# EAGLE schematic Meshtastic-DIY_v1.05 (EAGLE 9.6.2)
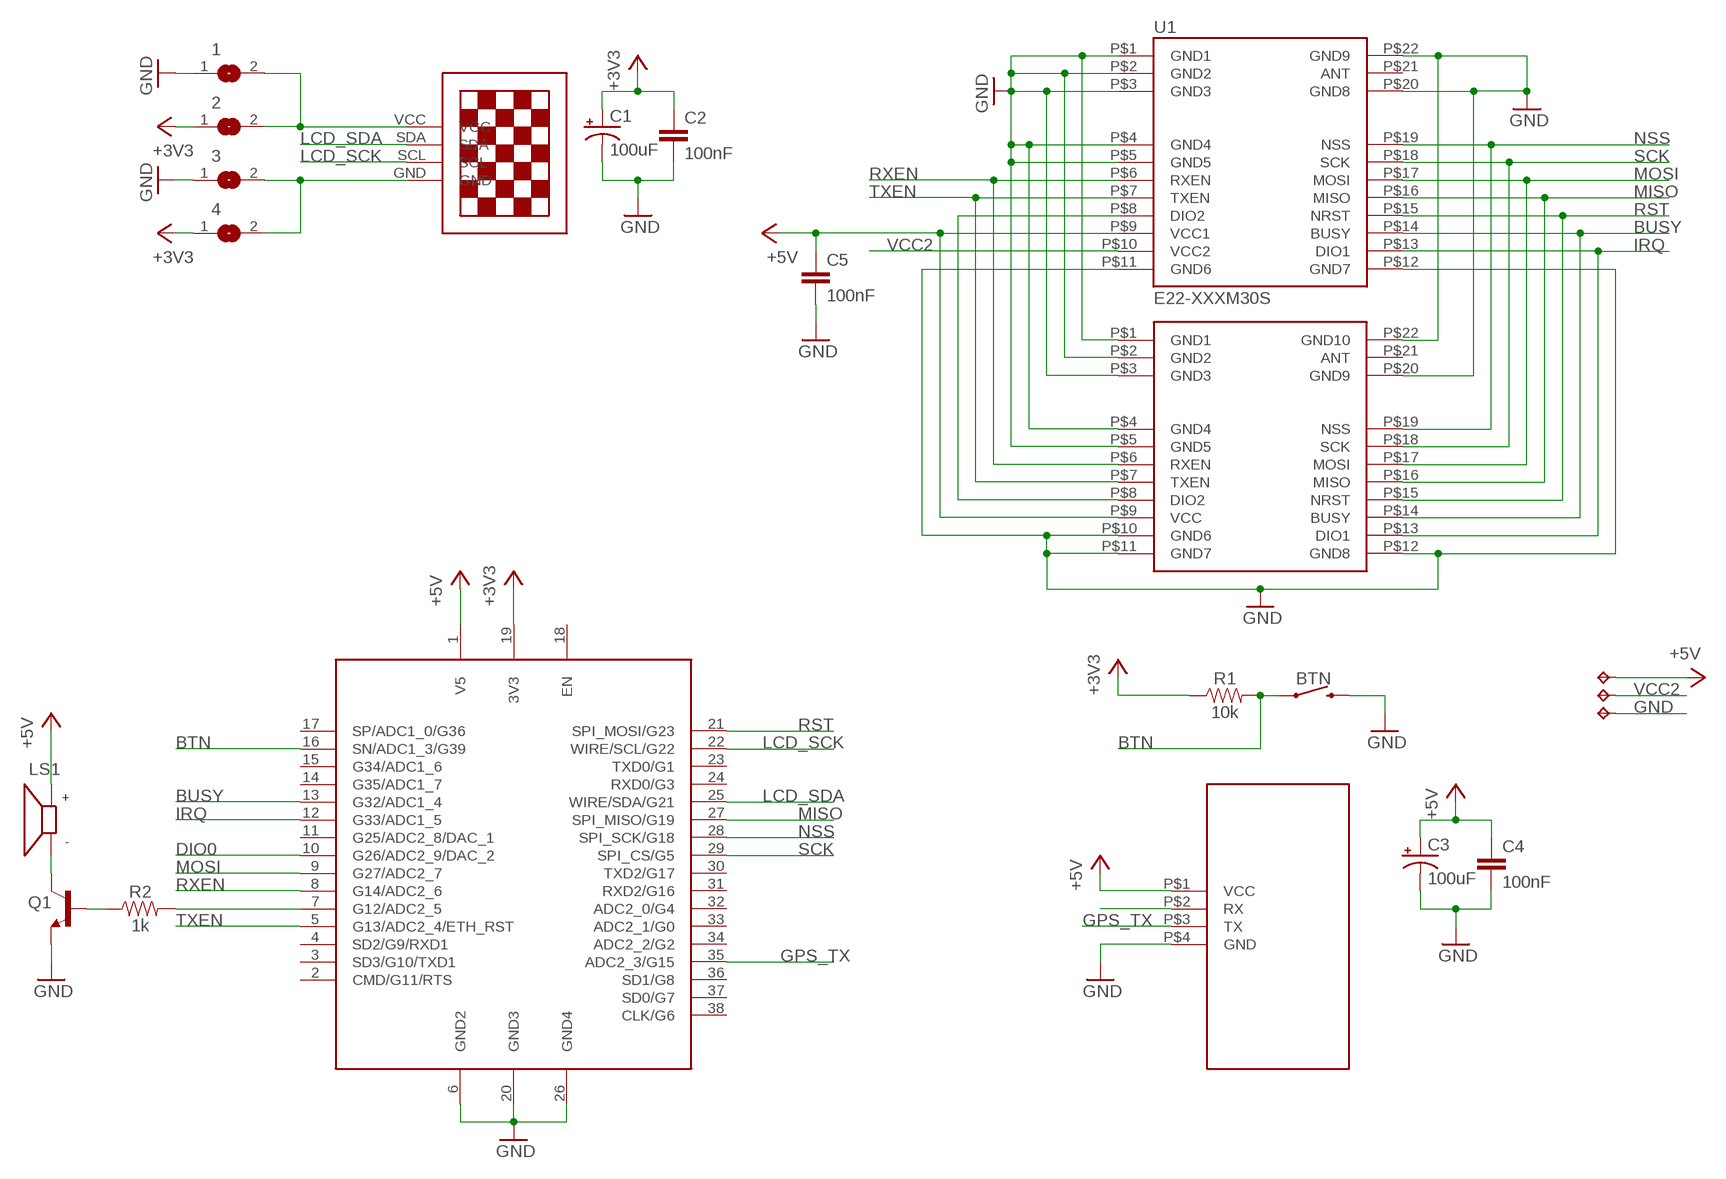
[diagram p0: schematic, sheet 1]

## Parts
1  SJ  [SJ]
2  SJ  [SJ]
3  SJ  [SJ]
4  SJ  [SJ]
BTN  MOMENTARY-SWITCH-SPST-PTH-6.0MM  [TACTILE_SWITCH_PTH_6.0MM]
C1  100uF  100UF-POLAR-RADIAL-2.5MM-25V-20%  [CPOL-RADIAL-2.5MM-6.5MM]
C2  100nF  0.33UF/330NF-0805-50V-10%  [0805]
C3  100uF  100UF-POLAR-RADIAL-2.5MM-25V-20%  [CPOL-RADIAL-2.5MM-6.5MM]
C4  100nF  0.33UF/330NF-0805-50V-10%  [0805]
C5  100nF  0.33UF/330NF-0805-50V-10%  [0805]
ESP32-1  NODEMCU_ESP32_WROOM_32  [NODEMCU_ESP32_WROOM_32--38PINS]
LS1  CMT-0926-86-SMT-TR  [XDCR_CMT-0926-86-SMT-TR]
Q1  200mA/40V  TRANS_NPN-2N3904  [TO-92]
R1  10k  0.1OHM-1210-1/2W-1%  [1210]
R2  1k  0.1OHM-1210-1/2W-1%  [1210]
TP1  TPTP14SQ  [TP14SQ]
TP2  TPTP14SQ  [TP14SQ]
TP3  TPTP14SQ  [TP14SQ]
U1  E22-XXXM30S  [E22-XXXM30S]
U$1  13"OLED13"OLED  [1.3"OLED]
U$2  E22-XXXM22S  [E22-XXXM22S]
U$3  GPS-NEO  [GPS-NEO]

## Nets
+3V3: 2.1 4.1 C1.1(+) C2.1 ESP32-1.19(3V3) R1.1
+5V: C3.1(+) C4.1 C5.1 ESP32-1.1(V5) LS1.P TP1.TP U1.P$9(VCC1) U$2.P$9(VCC) U$3.P$1(VCC)
BTN: BTN.1 ESP32-1.16(SN/ADC1_3/G39) R1.2
BUSY: ESP32-1.13(G32/ADC1_4) U1.P$14(BUSY) U$2.P$14(BUSY)
DIO0: ESP32-1.10(G26/ADC2_9/DAC_2)
GND: 1.1 3.1 BTN.3 C1.2(-) C2.2 C3.2(-) C4.2 C5.2 ESP32-1.6(GND2) ESP32-1.20(GND3) ESP32-1.26(GND4) Q1.1(E) TP3.TP U1.P$1(GND1) U1.P$2(GND2) U1.P$3(GND3) U1.P$4(GND4) U1.P$5(GND5) U1.P$11(GND6) U1.P$12(GND7) U1.P$20(GND8) U1.P$22(GND9) U$2.P$1(GND1) U$2.P$2(GND2) U$2.P$3(GND3) U$2.P$4(GND4) U$2.P$5(GND5) U$2.P$10(GND6) U$2.P$11(GND7) U$2.P$12(GND8) U$2.P$20(GND9) U$2.P$22(GND10) U$3.P$4(GND)
GPS_TX: ESP32-1.35(ADC2_3/G15) U$3.P$3(TX)
IRQ: ESP32-1.12(G33/ADC1_5) U1.P$13(DIO1) U$2.P$13(DIO1)
LCD_SCK: ESP32-1.22(WIRE/SCL/G22) U$1.SCL
LCD_SDA: ESP32-1.25(WIRE/SDA/G21) U$1.SDA
MISO: ESP32-1.27(SPI_MISO/G19) U1.P$16(MISO) U$2.P$16(MISO)
MOSI: ESP32-1.9(G27/ADC2_7) U1.P$17(MOSI) U$2.P$17(MOSI)
N$1: 1.2 2.2 U$1.VCC
N$2: 3.2 4.2 U$1.GND
N$3: U$3.P$2(RX)
N$4: LS1.N Q1.3(C)
N$5: ESP32-1.7(G12/ADC2_5) R2.2
N$6: Q1.2(B) R2.1
N$9: U1.P$8(DIO2) U$2.P$8(DIO2)
NSS: ESP32-1.28(SPI_SCK/G18) U1.P$19(NSS) U$2.P$19(NSS)
RST: ESP32-1.21(SPI_MOSI/G23) U1.P$15(NRST) U$2.P$15(NRST)
RXEN: ESP32-1.8(G14/ADC2_6) U1.P$6(RXEN) U$2.P$6(RXEN)
SCK: ESP32-1.29(SPI_CS/G5) U1.P$18(SCK) U$2.P$18(SCK)
TXEN: ESP32-1.5(G13/ADC2_4/ETH_RST) U1.P$7(TXEN) U$2.P$7(TXEN)
VCC2: TP2.TP U1.P$10(VCC2)
Unconnected: ESP32-1.3(SD3/G10/TXD1) ESP32-1.4(SD2/G9/RXD1) ESP32-1.11(G25/ADC2_8/DAC_1) ESP32-1.14(G35/ADC1_7) ESP32-1.15(G34/ADC1_6) ESP32-1.17(SP/ADC1_0/G36) ESP32-1.18(EN) ESP32-1.23(TXD0/G1) ESP32-1.24(RXD0/G3) ESP32-1.30(TXD2/G17) ESP32-1.31(RXD2/G16) ESP32-1.32(ADC2_0/G4) ESP32-1.33(ADC2_1/G0) ESP32-1.34(ADC2_2/G2) ESP32-1.36(SD1/G8) ESP32-1.37(SD0/G7) ESP32-1.38(CLK/G6) U1.P$21(ANT) U$2.P$21(ANT)

## Power pins joined to a net without a drawn wire
CMD/G11/RTS: ESP32-1.2(CMD/G11/RTS)

## Library data of the parts
1-4 = jumper:SJ: SMD solder JUMPER
BTN = SparkFun-Switches:MOMENTARY-SWITCH-SPST: Momentary Switch (Pushbutton) - SPST Normally-open (NO) SPST momentary switches (buttons, pushbuttons). Variants PTH-12MM - 12mm square, through-hole Momentary Pushbutton Switch - 12mm Square <https://www.sparkfun.com/products/9190> (COM-09190) PTH-6.0MM, PTH-6.0MM-KIT - 6.0mm square, through-hole Mini Pushbutton Switch <https://www.sparkfun.com/products/97> (COM-00097) KIT package intended for soldering kit's - only one side of pads' copper is exposed. PTH-RIGHT-ANGLE-KIT - Right-angle, through-hole Right Angle Tactile Button <https://www.sparkfun.com/products/10791> - Used on SparkFun BigTime Watch Kit <https://www.sparkfun.com/products/11734> SMD-12MM - 12mm square, surface-mount Tactile Button - SMD (12mm) <https://www.sparkfun.com/products/12993> (COM-12993) Used on SparkFun PicoBoard <https://www.sparkfun.com/products/11888> SMD-4.5MM - 4.5mm Square Trackball Switch Used on SparkFun Blackberry Trackballer Breakout <https://www.sparkfun.com/products/13169> SMD-4.6MMX2.8MM - 4.60mm x 2.80mm, surface mount Used on SparkFun SAMD21 Mini Breakout <https://www.sparkfun.com/products/13664> SMD-5.2MM, SMD-5.2-REDUNDANT - 5.2mm square, surface-mount Mini Pushbutton Switch - SMD <https://www.sparkfun.com/products/8720> (COM-08720) Used on Arduino Pro Mini <https://www.sparkfun.com/products/11114> REDUNDANT package connects both switch circuits together SMD-6.0X3.5MM - 6.0 x 3.5mm, surface mount Momentary Reset Switch SMD <https://www.sparkfun.com/products/8229> (COM-08229) SMD-6.2MM-TALL - 6.2mm square, surface mount Tactile Button - SMD (6mm) <https://www.sparkfun.com/products/12992> Used on SparkFun Digital Sandbox <https://www.sparkfun.com/products/12651> SMD-RIGHT-ANGLE - Right-angle, surface mount Used on SparkFun Block for Intel® Edison - Arduino <https://www.sparkfun.com/products/13036>; PROD_ID: SWCH-08441; SF_SKU: COM-00097
C1 C3 = SparkFun-Capacitors:100UF-POLAR: 100µF polarized capacitors A capacitor is a passive two-terminal electrical component used to store electrical energy temporarily in an electric field.; PROD_ID: CAP-08439
C2 C4 C5 = SparkFun-Capacitors:0.33UF/330NF: 0.33µF/330nF ceramic capacitors A capacitor is a passive two-terminal electrical component used to store electrical energy temporarily in an electric field.; PROD_ID: CAP-08469; VALUE: 0.33µF
ESP32-1 = ESP32 NODEMCU WROOM 32:NODEMCU_ESP32_WROOM_32: NODEMCU ESP32 WROOM 32 38 Pins PINOUT: https://cdn.shopify.com/s/files/1/1509/1638/files/ESP_-_32_NodeMCU_Developmentboard_Pinout_Diagram.jpg?4479111012146266271; ESP: ESP32 WROOM 32
LS1 = CMT-0926-86-SMT-TR:CMT-0926-86-SMT-TR: CMT-0926-86-SMT-TR Check availability <https://pricing.snapeda.com/parts/CMT-0926-86-SMT-TR/CUI%20Devices/view-part?ref=eda>; AVAILABILITY: In Stock; CUI_PURCHASE_URL: https://www.cuidevices.com/product/audio/buzzers/audio-transducers/cmt-0926-86-smt-tr?utm_source=snapeda.com&utm_medium=referral&utm_campaign=snapedaBOM; DESCRIPTION: 9 mm, 3.6 Vo-p, 86 dB, Surface Mount (SMT), Magnetic Audio Transducer Buzzer; MF: CUI Devices; MP: CMT-0926-86-SMT-TR; PACKAGE: CUI Inc.; PRICE: None; PURCHASE-URL: https://pricing.snapeda.com/search/part/CMT-0926-86-SMT-TR/?ref=eda
Q1 = SparkFun-DiscreteSemi:TRANS_NPN: NPN transistor Current controlled devices typically used to amplify current or used as a switch. BC547 - COM-08928 <http://www.sparkfun.com/products/8928> (TO-92 45V 100mA) (1.Collector 2.Base 3.Emitter) 2N3904 - COM-00521 <http://www.sparkfun.com/products/521> (TO-92 40V 200mA) (1.Emitter 2.Base 3.Collector) P2N2222A - COM-12852 <http://www.sparkfun.com/products/12852> (TO-92 40V 600mA) (1.Collector 2.Base 3.Emitter); PROD_ID: TRANS-08447
R1 R2 = SparkFun-Resistors:0.1OHM: 0.1Ω resistor A resistor is a passive two-terminal electrical component that implements electrical resistance as a circuit element. Resistors act to reduce current flow, and, at the same time, act to lower voltage levels within circuits. - Wikipedia; PROD_ID: RES-12374; VALUE: 0.1
TP1-TP3 = testpad:TP: Test pad
U1 = E22-XXXMXXS:E22-XXXM30S
U$1 = 13oled:13"OLED
U$2 = E22-XXXMXXS:E22-XXXM22S
U$3 = 13oled:GPS-NEO